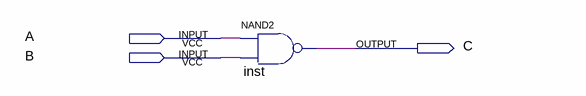
[diagram p0: schematic sheet]
// Quartus schematic nandgate.bdf as structural Verilog: 1 symbols, 3 pins
module nandgate (
  input  A,
  input  B,
  output C
);

  nand inst (C, A, B);
endmodule
